# Altium schematic sheet power and clocks.SCHDOC: Backplane
size B; Engineer: Eric Jonas; Organization: Wilson Lab; Address1: Picower Institute, MIT; Address2: 43 Vassar St. 46-5227; Address3: Cambridge, MA 02139; Address4: Australia 2086
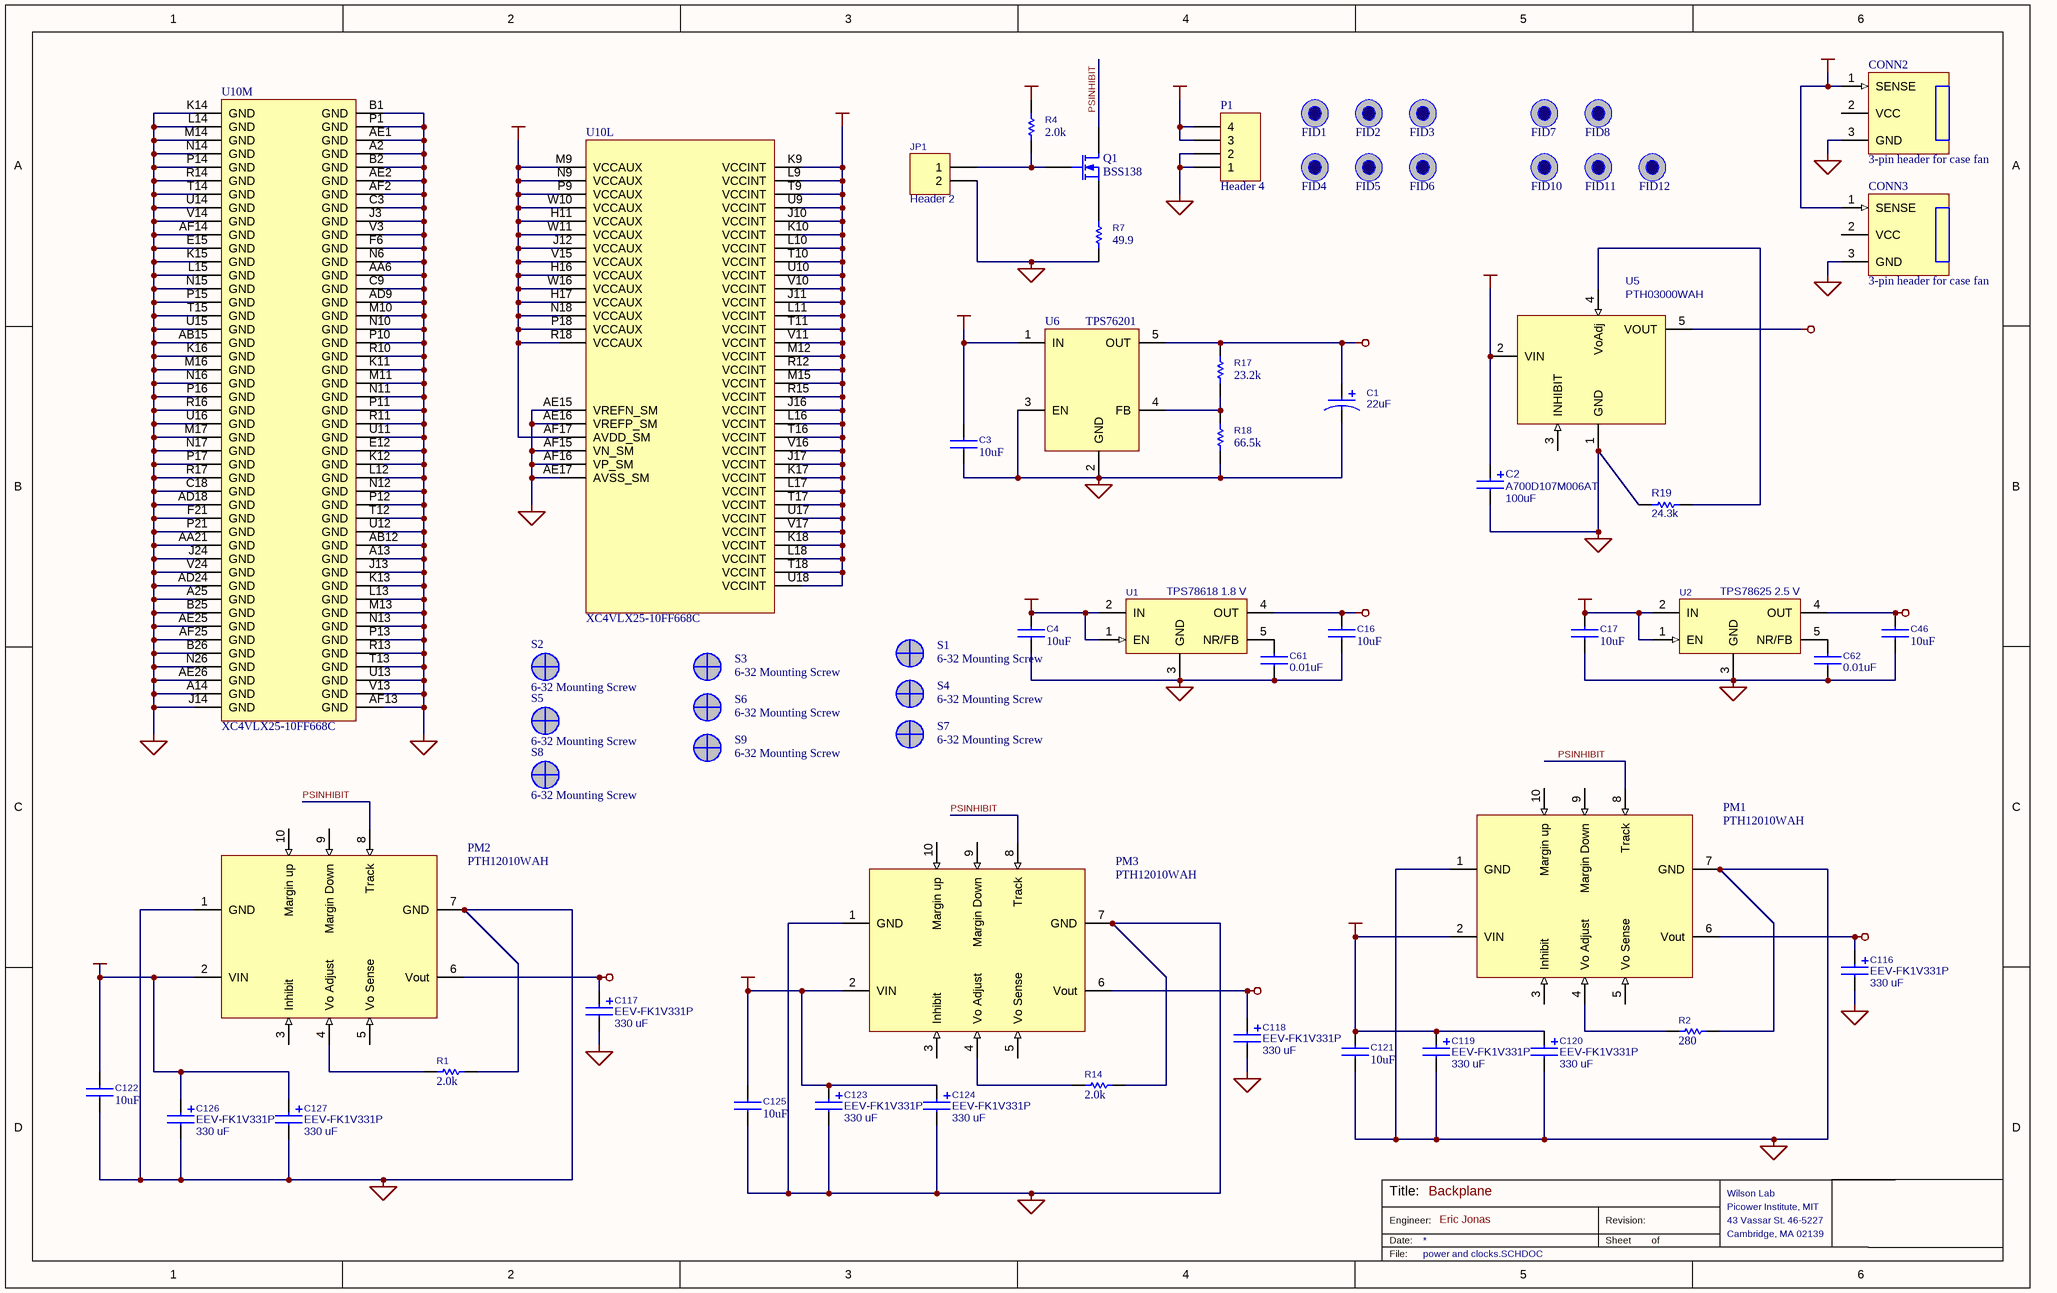
[diagram p0: power and clocks.SCHDOC]

## Parts
C1  value 22uF  [6032]  (hidden comment: POLCAP2)
C2  A700D107M006AT  value 100uF  [7343]
C3  10uF  [1206]
C4  10uF  [1206]
C16  10uF  [1206]
C17  10uF  [1206]
C46  10uF  [1206]
C61  value 0.01uF  [0402]  (hidden comment: CAPACITOR)
C62  value 0.01uF  [0402]  (hidden comment: CAPACITOR)
C116  EEV-FK1V331P  value 330 uF  [PanasonicG]
C117  EEV-FK1V331P  value 330 uF  [PanasonicG]
C118  EEV-FK1V331P  value 330 uF  [PanasonicG]
C119  EEV-FK1V331P  value 330 uF  [PanasonicG]
C120  EEV-FK1V331P  value 330 uF  [PanasonicG]
C121  10uF  [1206]
C122  10uF  [1206]
C123  EEV-FK1V331P  value 330 uF  [PanasonicG]
C124  EEV-FK1V331P  value 330 uF  [PanasonicG]
C125  10uF  [1206]
C126  EEV-FK1V331P  value 330 uF  [PanasonicG]
C127  EEV-FK1V331P  value 330 uF  [PanasonicG]
CONN2  3-pin header for case fan  [CASEFANHDR]
CONN3  3-pin header for case fan  [CASEFANHDR]
FID1  FIDUCIAL  [FIDUCIAL]  (value not drawn)
FID2  FIDUCIAL  [FIDUCIAL]  (value not drawn)
FID3  FIDUCIAL  [FIDUCIAL]  (value not drawn)
FID4  FIDUCIAL  [FIDUCIAL]  (value not drawn)
FID5  FIDUCIAL  [FIDUCIAL]  (value not drawn)
FID6  FIDUCIAL  [FIDUCIAL]  (value not drawn)
FID7  FIDUCIAL  [FIDUCIAL]  (value not drawn)
FID8  FIDUCIAL  [FIDUCIAL]  (value not drawn)
FID10  FIDUCIAL  [FIDUCIAL]  (value not drawn)
FID11  FIDUCIAL  [FIDUCIAL]  (value not drawn)
FID12  FIDUCIAL  [FIDUCIAL]  (value not drawn)
JP1  Header 2  [HDR1X2]
P1  Header 4  [MOLEX 39-29-9042]
PM1  PTH12010WAH  [PTH12010WAH]
PM2  PTH12010WAH  [PTH12010WAH]
PM3  PTH12010WAH  [PTH12010WAH]
Q1  BSS138  [SO-G3/D4.1]
R1  2.0k  [1206]
R2  280  [1206]
R4  value 2.0k  [1206]  (hidden comment: 5k)
R7  value 49.9  [1206]  (hidden comment: 50)
R14  2.0k  [1206]
R17  23.2k  [1206]
R18  66.5k  [1206]
R19  value 24.3k  [1206]  (hidden comment: RESISTOR)
S1  6-32 Mounting Screw  [SCREW6-32]
S2  6-32 Mounting Screw  [SCREW6-32]
S3  6-32 Mounting Screw  [SCREW6-32]
S4  6-32 Mounting Screw  [SCREW6-32]
S5  6-32 Mounting Screw  [SCREW6-32]
S6  6-32 Mounting Screw  [SCREW6-32]
S7  6-32 Mounting Screw  [SCREW6-32]
S8  6-32 Mounting Screw  [SCREW6-32]
S9  6-32 Mounting Screw  [SCREW6-32]
U1  TPS78618 1.8 V  [KTT]
U2  TPS78625 2.5 V  [KTT]
U5  PTH03000WAH  [TI EUS]
U6  TPS76201  [SO-G5/X.5]
U10  XC4VLX25-10FF668C  [Xilinx FF668]  (parts L,M of 13)

## Nets
+0.9VCC: C1.1 R17.1 U6.5(OUT)
+1.2VCC: U5.5(VOUT) U10.J10(VCCINT) U10.J11(VCCINT) U10.J16(VCCINT) U10.J17(VCCINT) U10.K9(VCCINT) U10.K10(VCCINT) U10.K17(VCCINT) U10.K18(VCCINT) U10.L9(VCCINT) U10.L10(VCCINT) U10.L11(VCCINT) U10.L16(VCCINT) U10.L17(VCCINT) U10.L18(VCCINT) U10.M12(VCCINT) U10.M15(VCCINT) U10.R12(VCCINT) U10.R15(VCCINT) U10.T9(VCCINT) U10.T10(VCCINT) U10.T11(VCCINT) U10.T16(VCCINT) U10.T17(VCCINT) U10.T18(VCCINT) U10.U9(VCCINT) U10.U10(VCCINT) U10.U17(VCCINT) U10.U18(VCCINT) U10.V10(VCCINT) U10.V11(VCCINT) U10.V16(VCCINT) U10.V17(VCCINT)
+1.8VCC: C16.2 U1.4(OUT)
+2.5VCC: C46.2 U2.4(OUT) U10.AF17(AVDD_SM) U10.H11(VCCAUX) U10.H16(VCCAUX) U10.H17(VCCAUX) U10.J12(VCCAUX) U10.M9(VCCAUX) U10.N9(VCCAUX) U10.N18(VCCAUX) U10.P9(VCCAUX) U10.P18(VCCAUX) U10.R18(VCCAUX) U10.V15(VCCAUX) U10.W10(VCCAUX) U10.W11(VCCAUX) U10.W16(VCCAUX)
+5VCC: C116.1 PM1.6(Vout)
+12VCC: C119.1 C120.1 C121.2 C122.2 C123.1 C124.1 C125.2 C126.1 C127.1 CONN2.1(SENSE) CONN3.1(SENSE) P1.3 P1.4 PM1.2(VIN) PM2.2(VIN) PM3.2(VIN)
GND: C1.2 C2.2 C3.1 C4.1 C16.1 C17.1 C46.1 C61.2 C62.2 C116.2 C117.2 C118.2 C119.2 C120.2 C121.1 C122.1 C123.2 C124.2 C125.1 C126.2 C127.2 CONN2.3(GND) CONN3.3(GND) JP1.2 P1.1 P1.2 PM1.1(GND) PM1.7(GND) PM2.1(GND) PM2.7(GND) PM3.1(GND) PM3.7(GND) R1.1 R2.1 R7.2 R14.1 R18.2 R19.2 U1.3(GND) U2.3(GND) U5.1(GND) U6.2(GND) U6.3(EN) U10.A2(GND) U10.A13(GND) U10.A14(GND) U10.A25(GND) U10.AA6(GND) U10.AA21(GND) U10.AB12(GND) U10.AB15(GND) U10.AD9(GND) U10.AD18(GND) U10.AD24(GND) U10.AE1(GND) U10.AE2(GND) U10.AE15(VREFN_SM) U10.AE16(VREFP_SM) U10.AE17(AVSS_SM) U10.AE25(GND) U10.AE26(GND) U10.AF2(GND) U10.AF13(GND) U10.AF14(GND) U10.AF15(VN_SM) U10.AF16(VP_SM) U10.AF25(GND) U10.B1(GND) U10.B2(GND) U10.B25(GND) U10.B26(GND) U10.C3(GND) U10.C9(GND) U10.C18(GND) U10.E12(GND) U10.E15(GND) U10.F6(GND) U10.F21(GND) U10.J3(GND) U10.J13(GND) U10.J14(GND) U10.J24(GND) U10.K11(GND) U10.K12(GND) U10.K13(GND) U10.K14(GND) U10.K15(GND) U10.K16(GND) U10.L12(GND) U10.L13(GND) U10.L14(GND) U10.L15(GND) U10.M10(GND) U10.M11(GND) U10.M13(GND) U10.M14(GND) U10.M16(GND) U10.M17(GND) U10.N6(GND) U10.N10(GND) U10.N11(GND) U10.N12(GND) U10.N13(GND) U10.N14(GND) U10.N15(GND) U10.N16(GND) U10.N17(GND) U10.N26(GND) U10.P1(GND) U10.P10(GND) U10.P11(GND) U10.P12(GND) U10.P13(GND) U10.P14(GND) U10.P15(GND) U10.P16(GND) U10.P17(GND) U10.P21(GND) U10.R10(GND) U10.R11(GND) U10.R13(GND) U10.R14(GND) U10.R16(GND) U10.R17(GND) U10.T12(GND) U10.T13(GND) U10.T14(GND) U10.T15(GND) U10.U11(GND) U10.U12(GND) U10.U13(GND) U10.U14(GND) U10.U15(GND) U10.U16(GND) U10.V3(GND) U10.V13(GND) U10.V14(GND) U10.V24(GND)
VCC: C2.1 C3.2 C4.2 C17.2 C117.1 PM2.6(Vout) R4.1 U1.1(EN) U1.2(IN) U2.1(EN) U2.2(IN) U5.2(VIN) U6.1(IN)
VCC2: C118.1 PM3.6(Vout)
PSINHIBIT: PM1.8(Track) PM2.8(Track) PM3.8(Track) Q1.1(D)
NetC61_1: C61.1 U1.5(NR/FB)
NetC62_1: C62.1 U2.5(NR/FB)
NetJP1_1: JP1.1 Q1.2(G) R4.2
NetPM1_4: PM1.4(Vo_Adjust) R2.2
NetPM2_4: PM2.4(Vo_Adjust) R1.2
NetPM3_4: PM3.4(Vo_Adjust) R14.2
NetQ1_3: Q1.3(S) R7.1
NetR17_2: R17.2 R18.1 U6.4(FB)
NetR19_1: R19.1 U5.4(VoAdj)

Not connected (* = marked no-connect by the designer): CONN2 2(VCC); CONN3 2(VCC); PM1 3(Inhibit) 5(Vo_Sense) 9(Margin_Down) 10(Margin_up); PM2 3(Inhibit) 5(Vo_Sense) 9(Margin_Down) 10(Margin_up); PM3 3(Inhibit) 5(Vo_Sense) 9(Margin_Down) 10(Margin_up); U5 3(INHIBIT)

## Notes on the sheet
- Title:
- Engineer:
- Date:
- Revision:
- Sheet
- of
- File:

## Library data of the parts
C1 = POLCAP2: Standard Capacitor
C2 C116-C120 C123 C124 C126 C127 = POLCAP: Standard Capacitor
C3 C4 C16 C17 C46 C61 C62 C121 C122 C125 = CAPACITOR: Standard Capacitor
  C3 C4 C16 C17 C46 C121 C122 C125: Value: 10uF
CONN2 CONN3 = PCFANHEADER
JP1 = Header 2: Header, 2-Pin; Manufacturer: Generic Components; Class I: Connector; Revision: July-2002: Re-released for DXP Platform.; Publisher: Altium Limited
P1 = Header 4: Header, 4-Pin; LatestRevisionDate: 17-Jul-2002; LatestRevisionNote: Re-released for DXP Platform.; Publisher: Altium Limited
PM1-PM3 = PTH12010W: 12A 12V Input Non-isolated wide-output adj
R1 R2 R4 R7 R14 R17-R19 = RESISTOR: Standard Passive Resistor; Tolerance: 1%
  R1 R14: Value: 2.0k
  R2: Value: 280
  R17: Value: 23.2k
  R18: Value: 66.5k
S1-S9 = MNTSCREW
U1 = TPS768XX: TI 1.5A LDO
U2 = TPS786XX: TI 1.5A LDO
U5 = PTH03000
U6 = TSP76201: TI 100mA LDO
U10 = XC4VLX25-10FF668C: Xilinx Virtex-4